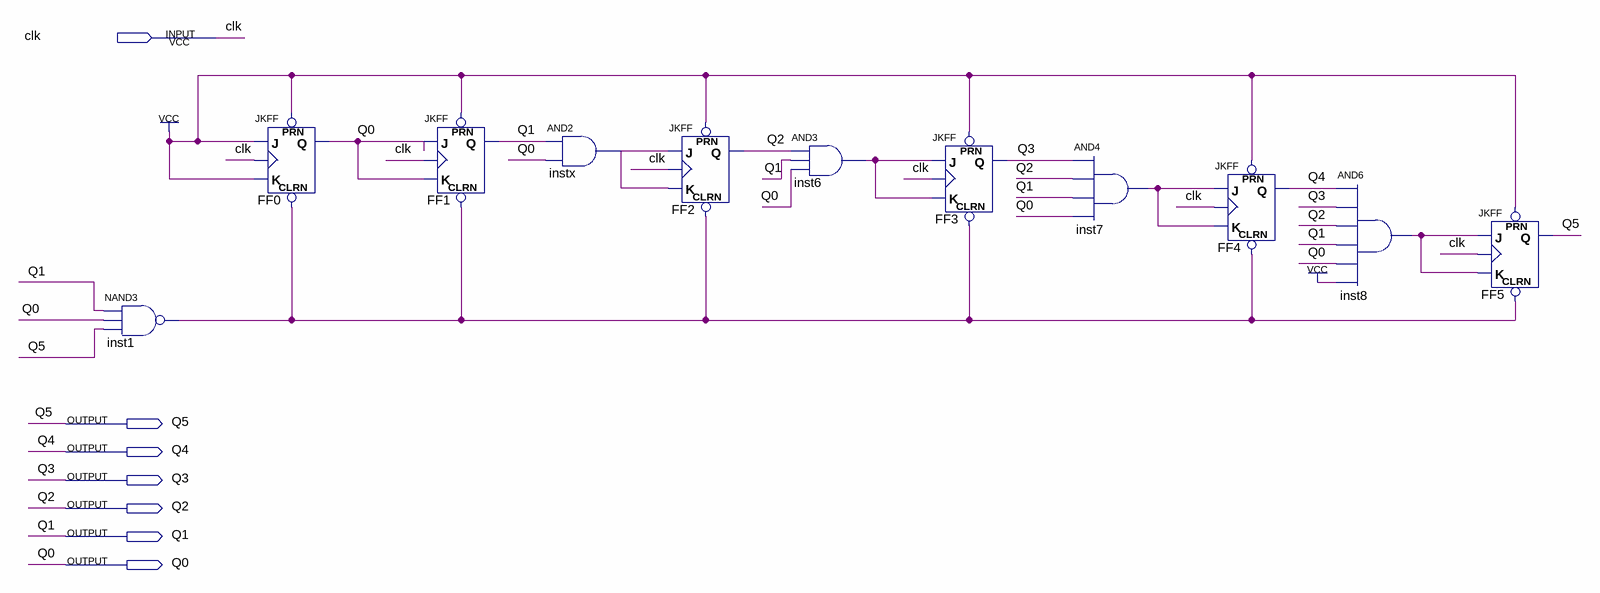
[diagram p0: schematic sheet]
// Quartus schematic Contador35.bdf as structural Verilog: 11 symbols, 7 pins
module Contador35 (
  input  clk,
  output Q5,
  output Q4,
  output Q3,
  output Q2,
  output Q1,
  output Q0
);

  wire inst1_out, inst6_out, inst7_out, inst8_out, instx_out;

  nand inst1 (inst1_out, Q1, Q0, Q5);
  JKFF FF0 (.PRN(1'b1), .CLRN(inst1_out), .K(1'b1), .J(1'b1), .CLK(clk), .Q(Q0));
  JKFF FF1 (.PRN(1'b1), .CLRN(inst1_out), .K(Q0), .J(Q0), .CLK(clk), .Q(Q1));
  and instx (instx_out, Q1, Q0);
  JKFF FF2 (.PRN(1'b1), .CLRN(inst1_out), .K(instx_out), .J(instx_out), .CLK(clk), .Q(Q2));
  and inst6 (inst6_out, Q2, Q1, Q0);
  JKFF FF3 (.PRN(1'b1), .CLRN(inst1_out), .K(inst6_out), .J(inst6_out), .CLK(clk), .Q(Q3));
  and inst7 (inst7_out, Q3, Q2, Q1, Q0);
  JKFF FF4 (.PRN(1'b1), .CLRN(inst1_out), .K(inst7_out), .J(inst7_out), .CLK(clk), .Q(Q4));
  and inst8 (inst8_out, Q4, Q3, Q2, Q1, Q0, 1'b1);
  JKFF FF5 (.PRN(1'b1), .CLRN(inst1_out), .K(inst8_out), .J(inst8_out), .CLK(clk), .Q(Q5));
endmodule
